# EAGLE design Turret Shield (EAGLE 9.6.2)
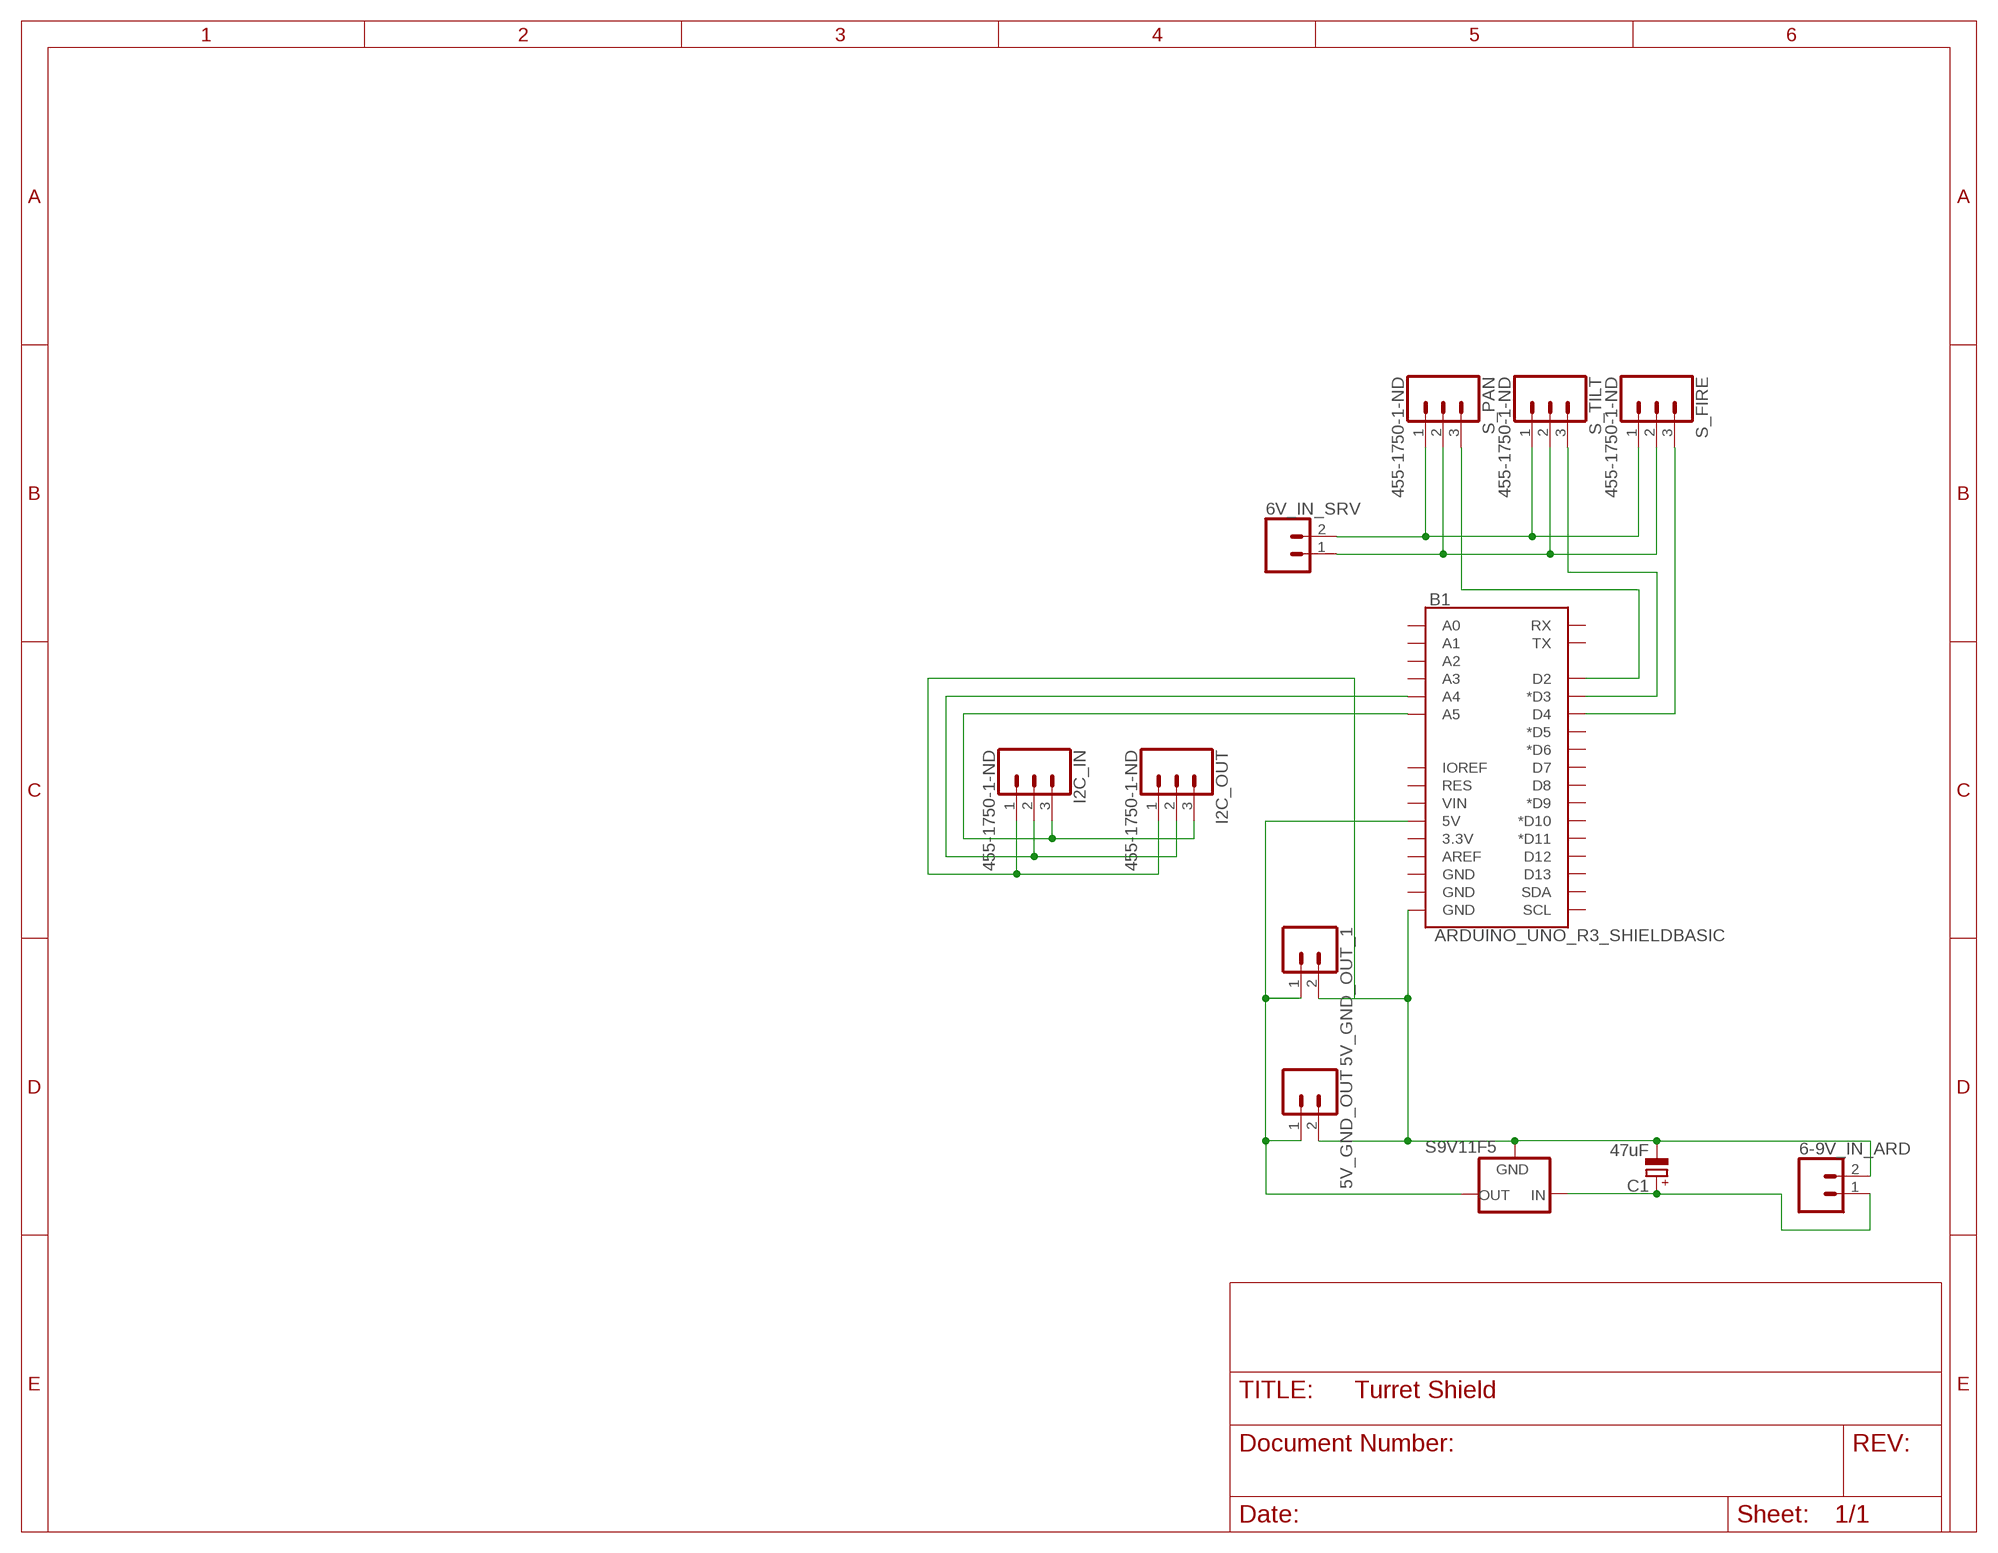
[diagram p0: schematic, sheet 1]

## Parts
5V_GND_OUT  CONN_02  [1X02]
5V_GND_OUT_1  CONN_02  [1X02]
6-9V_IN_ARD  CONN_02  [1X02]
6V_IN_SRV  CONN_02  [1X02]
B1  ARDUINO_UNO_R3_SHIELDBASIC  [UNO_R3_SHIELD]
C1  47uF  CPOL-EUE2.5-6  [E2,5-6]
I2C_IN  455-1750-1-ND  CONN_03  [1X03]
I2C_OUT  455-1750-1-ND  CONN_03  [1X03]
S9V11F5  78XXS  [78XXS]
S_FIRE  455-1750-1-ND  CONN_03  [1X03]
S_PAN  455-1750-1-ND  CONN_03  [1X03]
S_TILT  455-1750-1-ND  CONN_03  [1X03]

## Nets
N$1: 6V_IN_SRV.1 S_FIRE.2 S_PAN.2 S_TILT.2
N$2: B1.D3(*D3) S_TILT.3
N$3: B1.D2 S_PAN.3
N$4: 6V_IN_SRV.2 S_FIRE.1 S_PAN.1 S_TILT.1
N$5: B1.D4 S_FIRE.3
N$6: 5V_GND_OUT.2 5V_GND_OUT_1.2 6-9V_IN_ARD.2 B1.GND@0(GND) C1.- I2C_IN.1 I2C_OUT.1 S9V11F5.GND
N$7: 5V_GND_OUT.1 5V_GND_OUT_1.1 B1.5V S9V11F5.OUT
N$8: 6-9V_IN_ARD.1 C1.+ S9V11F5.IN
N$9: B1.A5 I2C_IN.3 I2C_OUT.3
N$10: B1.A4 I2C_IN.2 I2C_OUT.2
Unconnected: B1.3.3V B1.A0 B1.A1 B1.A2 B1.A3 B1.AREF B1.D5(*D5) B1.D6(*D6) B1.D7 B1.D8 B1.D9(*D9) B1.D10(*D10) B1.D11(*D11) B1.D12 B1.D13 B1.GND@1(GND) B1.GND@2(GND) B1.IOREF B1.RES B1.RX B1.SCL B1.SDA B1.TX B1.VIN

## Library data of the parts
5V_GND_OUT 5V_GND_OUT_1 6-9V_IN_ARD 6V_IN_SRV = SparkFun-Connectors:CONN_02: Multi connection point. Often used as Generic Header-pin footprint for 0.1 inch spaced/style header connections On any of the 0.1 inch spaced packages, you can populate with these: Break Away Headers - Straight <https://www.sparkfun.com/products/116> (PRT-00116) Break Away Male Headers - Right Angle <https://www.sparkfun.com/products/553> (PRT-00553) Female Headers <https://www.sparkfun.com/products/115> (PRT-00115) Break Away Headers - Machine Pin <https://www.sparkfun.com/products/117> (PRT-00117) Break Away Female Headers - Swiss Machine Pin <https://www.sparkfun.com/products/743> (PRT-00743) For SCREWTERMINALS and SPRING TERMINALS visit here: Screw Terimnals on SparkFun.com <https://www.sparkfun.com/search/results?term=Screw+Terminals> (5mm/3.5mm/2.54mm spacing) This device is also useful as a general connection point to wire up your design to another part of your project. Our various solder wires solder well into these plated through hole pads. Hook-Up Wire - Assortment (Stranded, 22 AWG) <https://www.sparkfun.com/products/11375> (PRT-11375) Hook-Up Wire - Assortment (Solid Core, 22 AWG) <https://www.sparkfun.com/products/11367> (PRT-11367) View the entire wire category on our website here <https://www.sparkfun.com/categories/141> Special notes: Molex polarized connector foot print use with: PRT-08233 with associated crimp pins and housings. 2.54_SCREWTERM for use with PRT-10571. 3.5mm Screw Terminal footprints for PRT-08084 5mm Screw Terminal footprints for use with PRT-08432
B1 = SparkFun-Boards:ARDUINO_UNO_R3_SHIELD: Arduino R3 Shield Footprint Shield form compatible with the Arduino Uno R3. SparkFun Products: MG2639 Cellular Shield <https://www.sparkfun.com/products/13120> MIDI Shield <https://www.sparkfun.com/products/12898> R3 Stackable Headers Kit <https://www.sparkfun.com/products/11417>
C1 = rcl:CPOL-EU: POLARIZED CAPACITOR, European symbol; SPICEPREFIX: C
I2C_IN I2C_OUT S_FIRE S_PAN S_TILT = SparkFun-Connectors:CONN_03: Multi connection point. Often used as Generic Header-pin footprint for 0.1 inch spaced/style header connections On any of the 0.1 inch spaced packages, you can populate with these: Break Away Headers - Straight <https://www.sparkfun.com/products/116> (PRT-00116) Break Away Male Headers - Right Angle <https://www.sparkfun.com/products/553> (PRT-00553) Female Headers <https://www.sparkfun.com/products/115> (PRT-00115) Break Away Headers - Machine Pin <https://www.sparkfun.com/products/117> (PRT-00117) Break Away Female Headers - Swiss Machine Pin <https://www.sparkfun.com/products/743> (PRT-00743) Stackable Header - 3 Pin (Female, 0.1") <https://www.sparkfun.com/products/13875> (PRT-13875) For SCREWTERMINALS and SPRING TERMINALS visit here: Screw Terimnals on SparkFun.com <https://www.sparkfun.com/search/results?term=Screw+Terminals> (5mm/3.5mm/2.54mm spacing) This device is also useful as a general connection point to wire up your design to another part of your project. Our various solder wires solder well into these plated through hole pads. Hook-Up Wire - Assortment (Stranded, 22 AWG) <https://www.sparkfun.com/products/11375> (PRT-11375) Hook-Up Wire - Assortment (Solid Core, 22 AWG) <https://www.sparkfun.com/products/11367> (PRT-11367) View the entire wire category on our website here <https://www.sparkfun.com/categories/141> Special notes: Molex polarized connector foot print use with SKU : PRT-08232 with associated crimp pins and housings.; PROD_ID: XXX-00000
S9V11F5 = v-reg:78XXS: VOLTAGE REGULATOR

## Net classes
0 default: width 1.016 mm, drill 1.016 mm, clearance 0.508 mm

## Board
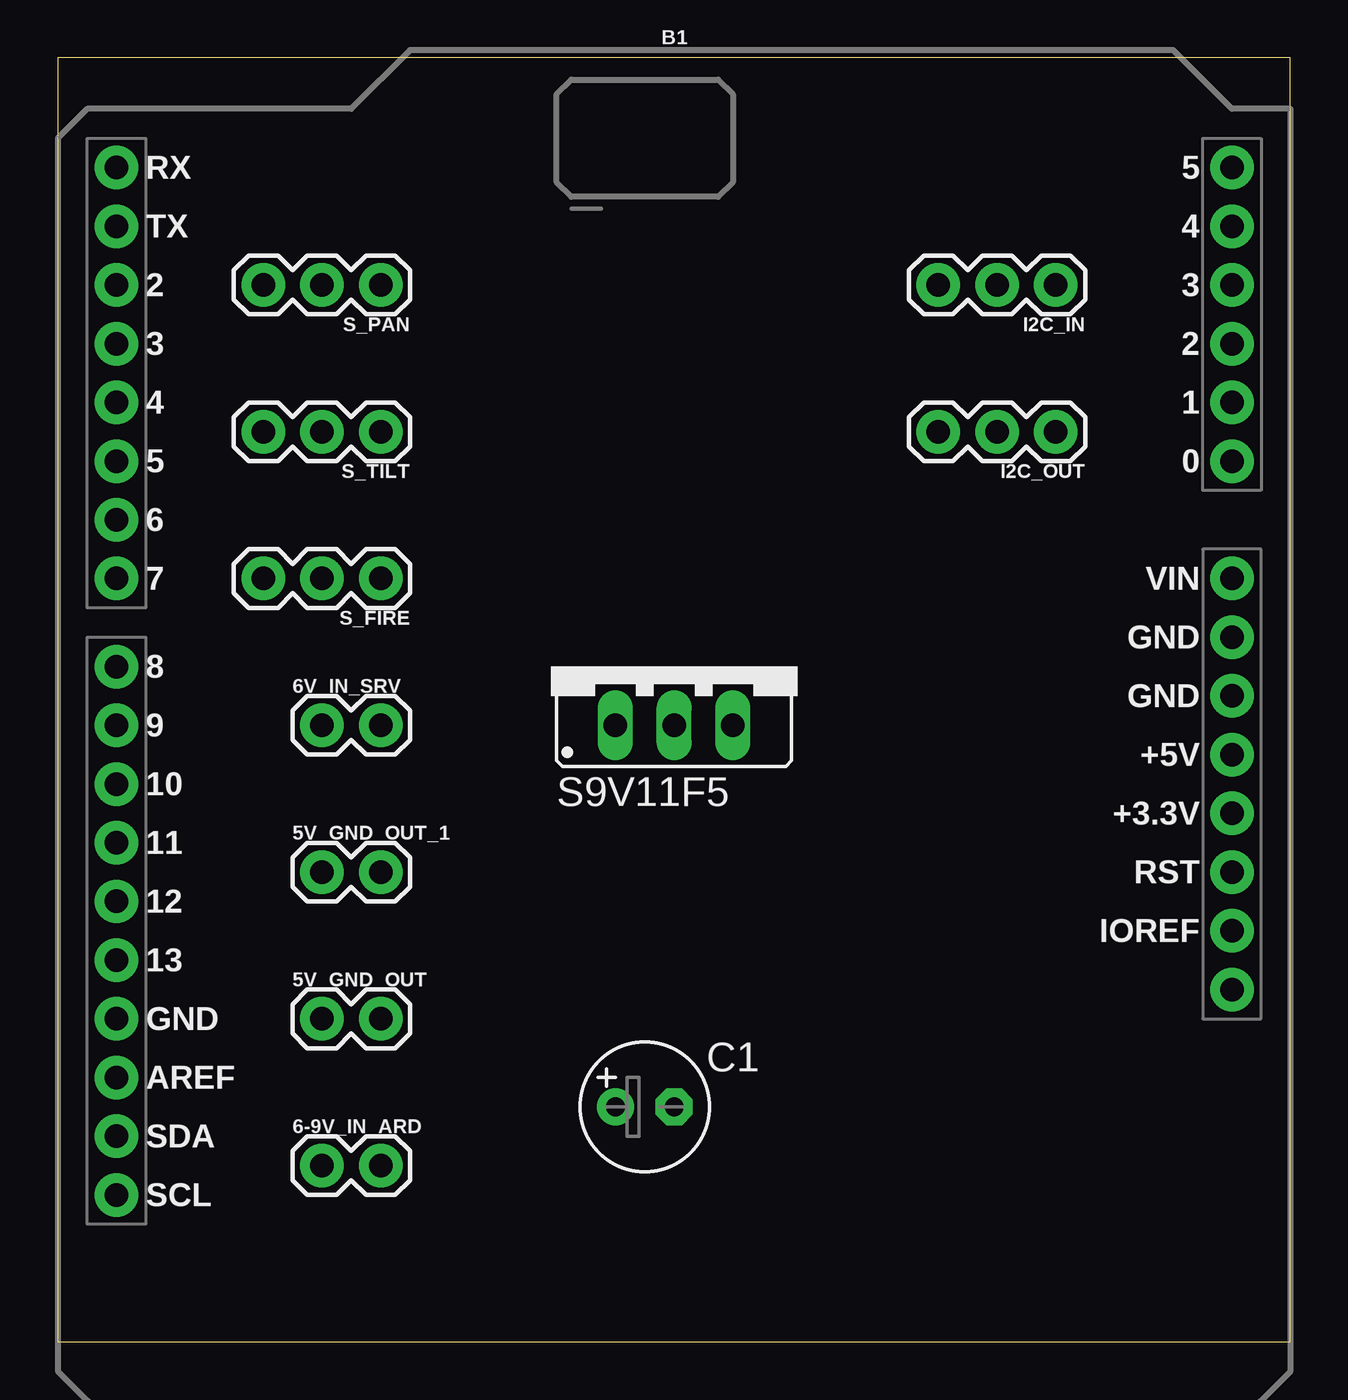
[diagram p1: board, top side]
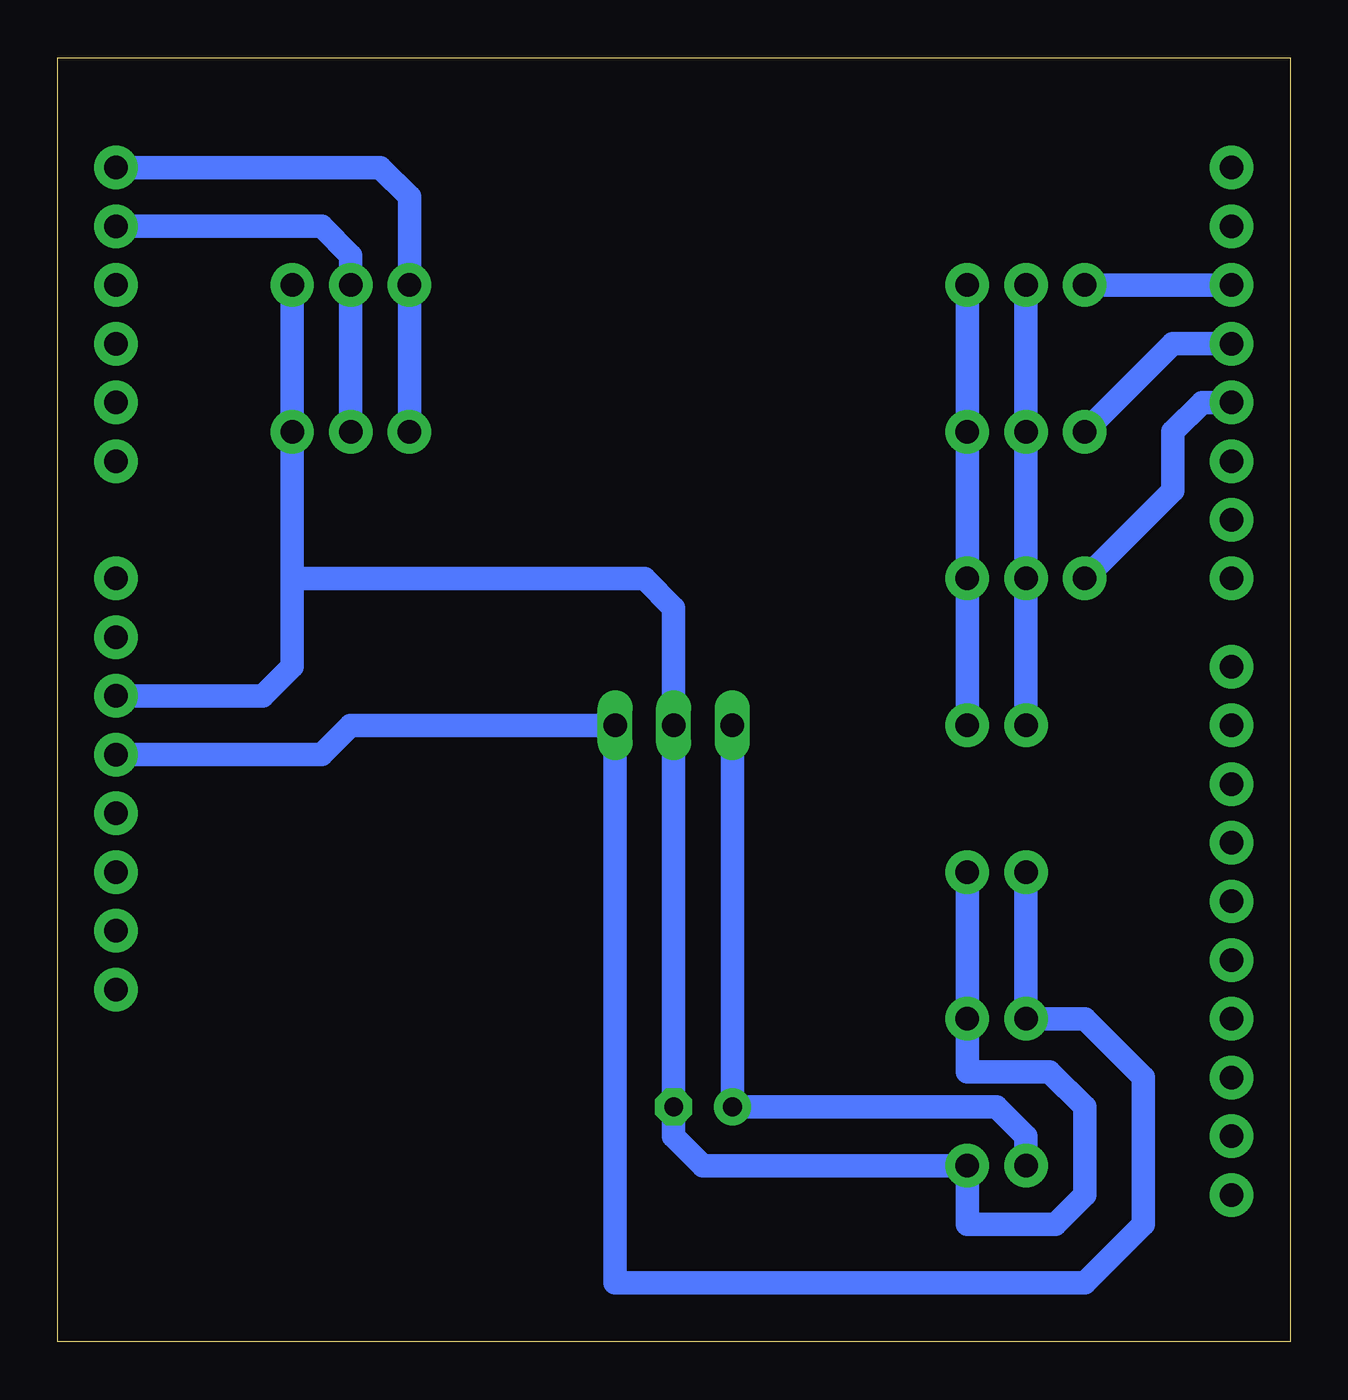
[diagram p2: board, bottom side, seen from below]

Size 53.32 x 55.55 mm. Coordinates in mm from the lower left corner, seen from the top.
Outline: 0,0 53.32,0 53.32,55.55 0,55.55 0,0
Copper layers (1*16): Top 0.035mm / dielectric 1.5mm / Bottom 0.035mm
Design rules "default": minimum track width 6mil, minimum drill 0.35mm, track to track 6mil, track to pad 6mil, pad to pad 6mil, via to via 6mil, smd to smd 6mil, copper to edge 40mil, drill to drill 6mil, minimum pad ring 10mil, minimum via ring 8mil, stop-mask expansion 4mil, vias tented up to drill 0mil, thermal gap 10mil

### Footprints (pad centres in the part's own frame; a part is rotated, then mirrored left to right if it is on the bottom)
1X02 = drill 1.016 pad 1.88: 1 0,0; 2 2.54,0
UNO_R3_SHIELD = drill 1.016 pad 1.88: 3.3V 24.13,-2.54; 5V 24.13,0; A0 24.13,12.7; A1 24.13,15.24; A2 24.13,17.78; A3 24.13,20.32; A4 24.13,22.86; A5 24.13,25.4; AREF -24.13,-13.97; D2 -24.13,20.32; D3 -24.13,17.78; D4 -24.13,15.24; D5 -24.13,12.7; D6 -24.13,10.16; D7 -24.13,7.62; D8 -24.13,3.81; D9 -24.13,1.27; D10 -24.13,-1.27; D11 -24.13,-3.81; D12 -24.13,-6.35; D13 -24.13,-8.89; GND@0 24.13,2.54; GND@1 24.13,5.08; GND@2 -24.13,-11.43; IOREF 24.13,-7.62; NC 24.13,-10.16; RES 24.13,-5.08; RX -24.13,25.4; SCL -24.13,-19.05; SDA -24.13,-16.51; TX -24.13,22.86; VIN 24.13,7.62
E2,5-6 = drill 0.813 pad 1.6: + -1.27,0 | drill 0.813 pad 1.6 octagon: - 1.27,0
1X03 = drill 1.016 pad 1.88: 1 0,0; 2 2.54,0; 3 5.08,0
78XXS = drill 1.016 long: GND 0,-2.54; IN -2.54,-2.54; OUT 2.54,-2.54

### Placement (x,y rotation side)
5V_GND_OUT  11.43,13.97 0 top
5V_GND_OUT_1  11.43,20.32 0 top
6-9V_IN_ARD  11.43,7.62 0 top
6V_IN_SRV  11.43,26.67 0 top
B1  26.67,25.4 0 top
C1  25.4,10.16 0 top
I2C_IN  43.18,45.72 180 top
I2C_OUT  43.18,39.37 180 top
S9V11F5  26.67,29.21 0 top
S_FIRE  13.97,33.02 180 top
S_PAN  13.97,45.72 180 top
S_TILT  13.97,39.37 180 top

### Tracks (layer width: path | path; a pad name or v marks a point on that pad's centre or on a via)
N$1
  Bottom 1.016: S_PAN.2 S_TILT.2 S_FIRE.2 6V_IN_SRV.1
N$2
  Bottom 1.016: S_TILT.3 5.08,43.18 B1.D3
N$3
  Bottom 1.016: S_PAN.3 B1.D2
N$4
  Bottom 1.016: S_PAN.1 S_TILT.1 S_FIRE.1 6V_IN_SRV.2
N$5
  Bottom 1.016: S_FIRE.3 5.08,36.83 5.08,39.37 3.81,40.64 B1.D4
N$6
  Bottom 1.016: I2C_IN.1 I2C_OUT.1 43.18,33.02 | B1.GND@0 44.45,27.94 43.18,29.21 43.18,33.02 | 43.18,33.02 27.94,33.02 26.67,31.75 S9V11F5.GND C1.- 26.67,8.89 25.4,7.62 6-9V_IN_ARD.2 13.97,5.08 10.16,5.08 8.89,6.35 8.89,10.16 10.41,11.68 13.97,11.68 5V_GND_OUT.2 5V_GND_OUT_1.2
N$7
  Bottom 1.016: 5V_GND_OUT_1.1 5V_GND_OUT.1 8.89,13.97 6.35,11.43 6.35,5.08 8.89,2.54 29.21,2.54 S9V11F5.OUT 40.64,26.67 41.91,25.4 B1.5V
N$8
  Bottom 1.016: S9V11F5.IN C1.+ 12.7,10.16 11.43,8.89 6-9V_IN_ARD.1
N$9
  Bottom 1.016: I2C_OUT.3 I2C_IN.3 38.1,49.53 39.37,50.8 B1.A5
N$10
  Bottom 1.016: I2C_OUT.2 I2C_IN.2 40.64,46.99 41.91,48.26 B1.A4